# EAGLE design f4mpac (EAGLE 7.4.0)
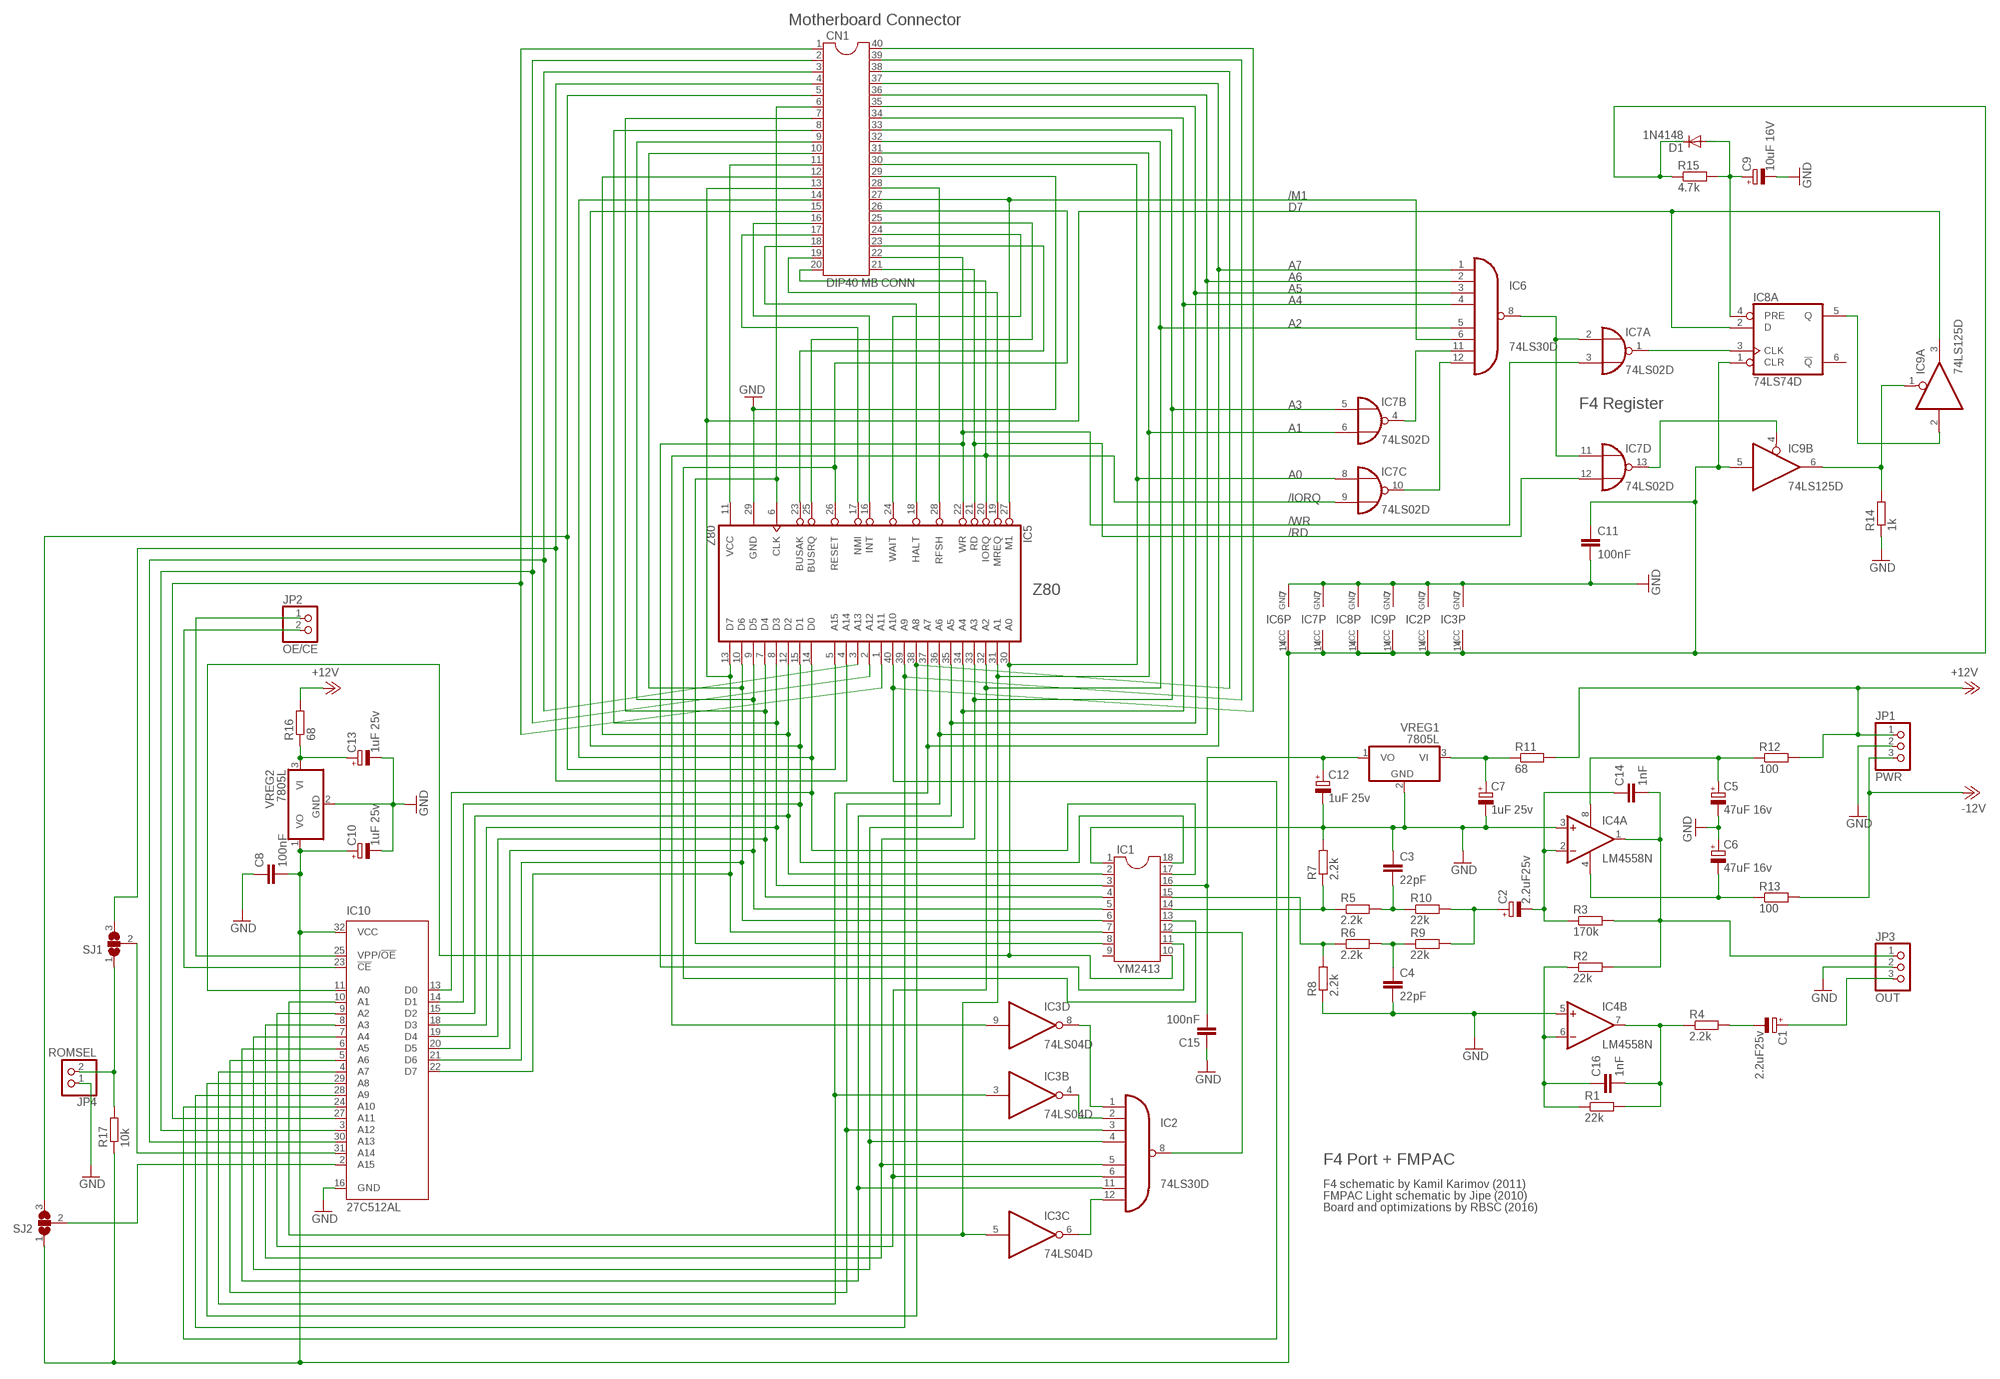
[diagram p0: schematic, sheet 1]

## Parts
C1  2.2uF25v  CPOL-EUSMCB  [SMC_B]
C2  2.2uF25v  CPOL-EUSMCB  [SMC_B]
C3  22pF  C-EUC0805  [C0805]
C4  22pF  C-EUC0805  [C0805]
C5  47uF 16v  CPOL-EUSMCC  [SMC_C]
C6  47uF 16v  CPOL-EUSMCC  [SMC_C]
C7  1uF 25v  CPOL-EUSMCB  [SMC_B]
C8  100nF  C-EUC0805  [C0805]
C9  10uF 16V  CPOL-EUSMCB  [SMC_B]
C10  1uF 25v  CPOL-EUSMCB  [SMC_B]
C11  100nF  C-EUC0805  [C0805]
C12  1uF 25v  CPOL-EUSMCB  [SMC_B]
C13  1uF 25v  CPOL-EUSMCB  [SMC_B]
C14  1nF  C-EUC0805  [C0805]
C15  100nF  C-EUC0805  [C0805]
C16  1nF  C-EUC0805  [C0805]
CN1  DIP40 MB CONN  DIL40  [DIL40]
D1  1N4148  DIODE-MINIMELF  [MINIMELF]
IC1  YM2413  DIL18  [DIL18]
IC2  74LS30D  [SO14]
IC3  74LS04D  [SO14]
IC4  LM4558N  [DIL08]
IC5  Z80  Z80CPU  [DIL40]
IC6  74LS30D  [SO14]
IC7  74LS02D  [SO14]
IC8  74LS74D  [SO14]
IC9  74LS125D  [SO14]
IC10  27C512AL  [PLCC-32]
JP1  PWR  PINHD-1X3/90  [1X03/90]
JP2  OE/CE  PINHD-1X2/90  [1X02/90]
JP3  OUT  PINHD-1X3/90  [1X03/90]
JP4  ROMSEL  PINHD-1X2/90  [1X02/90]
R1  22k  R-EU_R0805  [R0805]
R2  22k  R-EU_R0805  [R0805]
R3  170k  R-EU_R0805  [R0805]
R4  2.2k  R-EU_R0805  [R0805]
R5  2.2k  R-EU_R0805  [R0805]
R6  2.2k  R-EU_R0805  [R0805]
R7  2.2k  R-EU_R0805  [R0805]
R8  2.2k  R-EU_R0805  [R0805]
R9  22k  R-EU_R0805  [R0805]
R10  22k  R-EU_R0805  [R0805]
R11  68  R-EU_R0805  [R0805]
R12  100  R-EU_R0805  [R0805]
R13  100  R-EU_R0805  [R0805]
R14  1k  R-EU_R0805  [R0805]
R15  4.7k  R-EU_M0805  [M0805]
R16  68  R-EU_R0805  [R0805]
R17  10k  R-EU_R0805  [R0805]
SJ1  SJ2W  [SJ_2]
SJ2  SJ2W  [SJ_2]
VREG1  7805L  [TO92]
VREG2  7805L  [TO92]

## Nets
+5VREG: C8.2 C10.+ C11.1 D1.C IC2.14(VCC) IC3.14(P:VCC) IC6.14(VCC) IC7.14(P:VCC) IC8.1(A:CLR) IC8.14(P:VCC) IC9.5(B:I) IC9.14(P:VCC) IC10.32(VCC) R15.1 R17.1 SJ2.1 VREG2.1(VO)
+12V: JP1.1 R11.2 R12.2 R16.2
-12V: JP1.3 R13.2
A0: CN1.30 IC1.10 IC5.30(A0) IC7.8(C:I0) IC10.11(A0)
A1: CN1.31 IC3.5(C:I) IC5.31(A1) IC7.6(B:I1) IC10.10(A1)
A2: CN1.32 IC2.6(I5) IC5.32(A2) IC6.5(I4) IC10.9(A2)
A3: CN1.33 IC2.5(I4) IC5.33(A3) IC7.5(B:I0) IC10.8(A3)
A4: CN1.34 IC2.4(I3) IC5.34(A4) IC6.4(I3) IC10.7(A4)
A5: CN1.35 IC2.11(I6) IC5.35(A5) IC6.3(I2) IC10.6(A5)
A6: CN1.36 IC2.3(I2) IC5.36(A6) IC6.2(I1) IC10.5(A6)
A7: CN1.37 IC3.3(B:I) IC5.37(A7) IC6.1(I0) IC10.4(A7)
A8: CN1.38 IC5.38(A8) IC10.29(A8)
A9: CN1.39 IC5.39(A9) IC10.28(A9)
A10: CN1.40 IC5.40(A10) IC10.24(A10)
A11: CN1.1 IC5.1(A11) IC10.27(A11)
A12: CN1.2 IC5.2(A12) IC10.3(A12)
A13: CN1.3 IC5.3(A13) IC10.30(A13)
A14: CN1.4 IC5.4(A14) SJ1.3
A15: CN1.5 IC5.5(A15) SJ2.3
BUSAK: CN1.23 IC5.23(BUSAK)
BUSRQ: CN1.25 IC5.25(BUSRQ)
CLCK: CN1.6 IC1.8 IC5.6(CLK)
D0: CN1.14 IC1.17 IC5.14(D0) IC10.13(D0)
D1: CN1.15 IC1.18 IC5.15(D1) IC10.14(D1)
D2: CN1.12 IC1.2 IC5.12(D2) IC10.15(D2)
D3: CN1.8 IC1.3 IC5.8(D3) IC10.18(D3)
D4: CN1.7 IC1.4 IC5.7(D4) IC10.19(D4)
D5: CN1.9 IC1.5 IC5.9(D5) IC10.20(D5)
D6: CN1.10 IC1.6 IC5.10(D6) IC10.21(D6)
D7: CN1.13 IC1.7 IC5.13(D7) IC8.2(A:D) IC9.3(A:O) IC10.22(D7)
GND: C3.1 C4.2 C5.- C6.+ C7.- C8.1 C9.- C10.- C11.2 C12.- C13.- C15.1 CN1.29 IC1.1 IC2.7(GND) IC3.7(P:GND) IC4.3(A:+IN) IC4.5(B:+IN) IC5.29(GND) IC6.7(GND) IC7.7(P:GND) IC8.7(P:GND) IC9.7(P:GND) IC10.16(GND) JP1.2 JP3.2 JP4.1 R7.2 R8.1 R14.1 VREG1.2(GND) VREG2.2(GND)
HALT: CN1.18 IC5.18(HALT)
INT: CN1.16 IC5.16(INT)
IORQ: CN1.20 IC3.9(D:I) IC5.20(IORQ) IC7.9(C:I1)
M1: CN1.27 IC5.27(M1) IC6.6(I5)
MREQ: CN1.19 IC5.19(MREQ)
N$1: IC1.12 IC2.8(O)
N$2: C1.+ JP3.3
N$3: C7.+ R11.1 VREG1.3(VI)
N$5: C5.+ IC4.8(P:V+) R12.1
N$6: IC1.14 R5.1 R7.1
N$7: C2.- C14.1 IC4.2(A:-IN) R3.1
N$8: C6.- IC4.4(P:V-) R13.1
N$9: C16.1 IC4.6(B:-IN) R1.1 R2.1
N$10: IC10.31(A14) SJ1.2
N$11: C1.- R4.2
N$12: C3.2 R5.2 R10.1
N$13: IC1.15 R6.1 R8.2
N$14: C4.1 R6.2 R9.1
N$15: IC2.12(I7) IC3.6(C:O)
N$16: C2.+ R9.2 R10.2
N$17: IC2.2(I1) IC3.4(B:O)
N$18: IC2.1(I0) IC3.8(D:O)
N$19: C9.+ D1.A IC8.4(A:PRE) R15.2
N$20: IC10.25(VPP/!OE) JP2.1
N$21: IC10.23(!CE) JP2.2
N$22: C13.+ R16.1 VREG2.3(VI)
N$23: C12.+ C15.2 IC1.16 VREG1.1(VO)
N$24: IC6.11(I6) IC7.4(B:O)
N$25: IC10.2(A15) SJ2.2
N$26: JP4.2 R17.2 SJ1.1
N$27: C16.2 IC4.7(B:OUT) R1.2 R4.1
N$30: IC6.12(I7) IC7.10(C:O)
N$31: IC7.1(A:O) IC8.3(A:CLK)
N$32: IC7.13(D:O) IC9.4(B:OE)
N$33: IC6.8(O) IC7.2(A:I0) IC7.11(D:I0)
N$38: IC9.1(A:OE) IC9.6(B:O) R14.2
N$40: C14.2 IC4.1(A:OUT) JP3.1 R2.2 R3.2
N$41: IC8.5(A:Q) IC9.2(A:I)
NMI: CN1.17 IC5.17(NMI)
RD: CN1.21 IC5.21(RD) IC7.12(D:I1)
RFSH: CN1.28 IC5.28(RFSH)
RST: CN1.26 IC1.13 IC5.26(RESET)
VCC: CN1.11 IC5.11(VCC)
WAIT: CN1.24 IC5.24(WAIT)
WR: CN1.22 IC1.11 IC5.22(WR) IC7.3(A:I1)
Unconnected: IC1.9 IC3.1(A:I) IC3.2(A:O) IC3.10(E:O) IC3.11(E:I) IC3.12(F:O) IC3.13(F:I) IC8.6(A:!Q) IC8.8(B:!Q) IC8.9(B:Q) IC8.10(B:PRE) IC8.11(B:CLK) IC8.12(B:D) IC8.13(B:CLR) IC9.8(C:O) IC9.9(C:I) IC9.10(C:OE) IC9.11(D:O) IC9.12(D:I) IC9.13(D:OE)

## Notes on the sheet
- Motherboard Connector
- /M1
- D7
- A7
- A6
- A5
- A4
- A2
- A3 | F4 Register
- A1
- A0
- /IORQ
- /WR
- /RD
- Z80
- F4 Port + FMPAC
- F4 schematic by Kamil Karimov (2011)
- FMPAC Light schematic by Jipe (2010)
- Board and optimizations by RBSC (2016)

## Library data of the parts
C1 C2 C5-C7 C9 C10 C12 C13 = rcl:CPOL-EU: POLARIZED CAPACITOR, European symbol
C3 C4 C8 C11 C14-C16 = rcl:C-EU: CAPACITOR, European symbol
CN1 = ic-package:DIL40: Dual In Line
D1 = diode:DIODE-: DIODE
IC1 = ic-package:DIL18: Dual In Line / Socket
IC2 IC6 = 74xx-eu:74*30: 8-input NAND gate
IC3 = 74xx-eu:74*04: Hex INVERTER
IC4 = linear:*4558: OP AMP
IC5 = zilog:Z80CPU: Z80 FAMILY DEVICE
IC7 = 74xx-eu:74*02: Quad 2-input NOR gate
IC8 = 74xx-eu:74*74: Dual D type positive edge triggered FLIP FLOP, preset and clear
IC9 = 74xx-eu:74*125: Quad bus BUFFER, 3-state
IC10 = microchip:27*512A: CMOS EPROM 512 K (64 K x 8); MPN: M27C512-90C1; OC_FARNELL: 1218315; OC_NEWARK: 24M5090
JP1 JP3 = pinhead:PINHD-1X3: PIN HEADER
JP2 JP4 = pinhead:PINHD-1X2: PIN HEADER
R1-R17 = rcl:R-EU_: RESISTOR, European symbol
SJ1 SJ2 = jumper:SJ2W: SMD solder JUMPER
VREG1 VREG2 = linear:78*: Positive VOLTAGE REGULATOR Source: http://cache.national.com/ds/LM/LM78L05.pdf http://www.fairchildsemi.com/ds/LM/LM7805.pdf

## Board
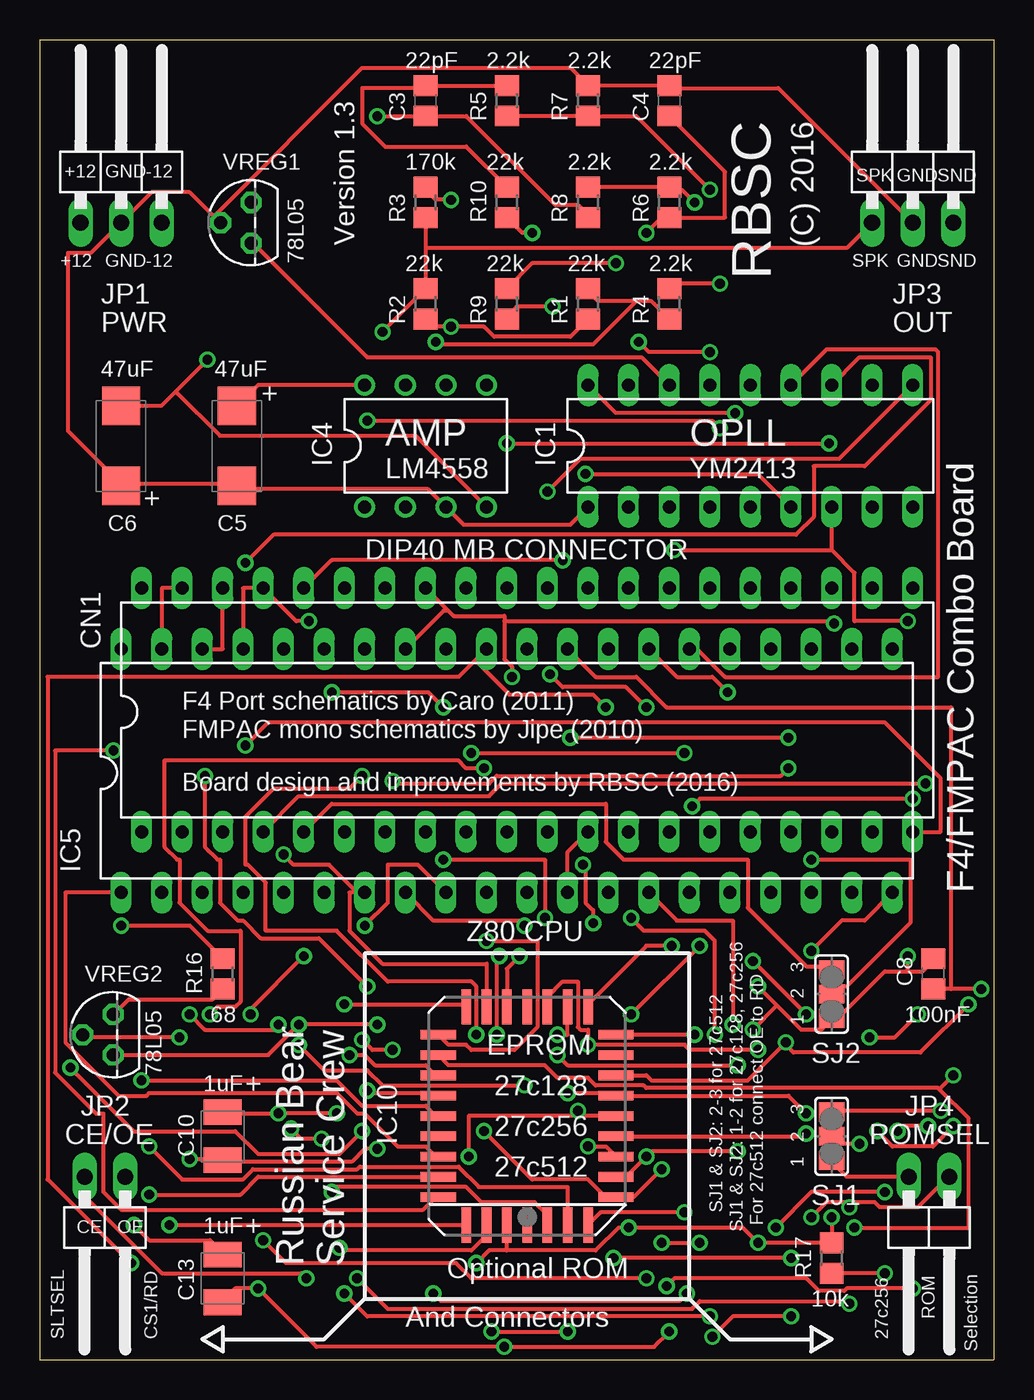
[diagram p1: board, top side]
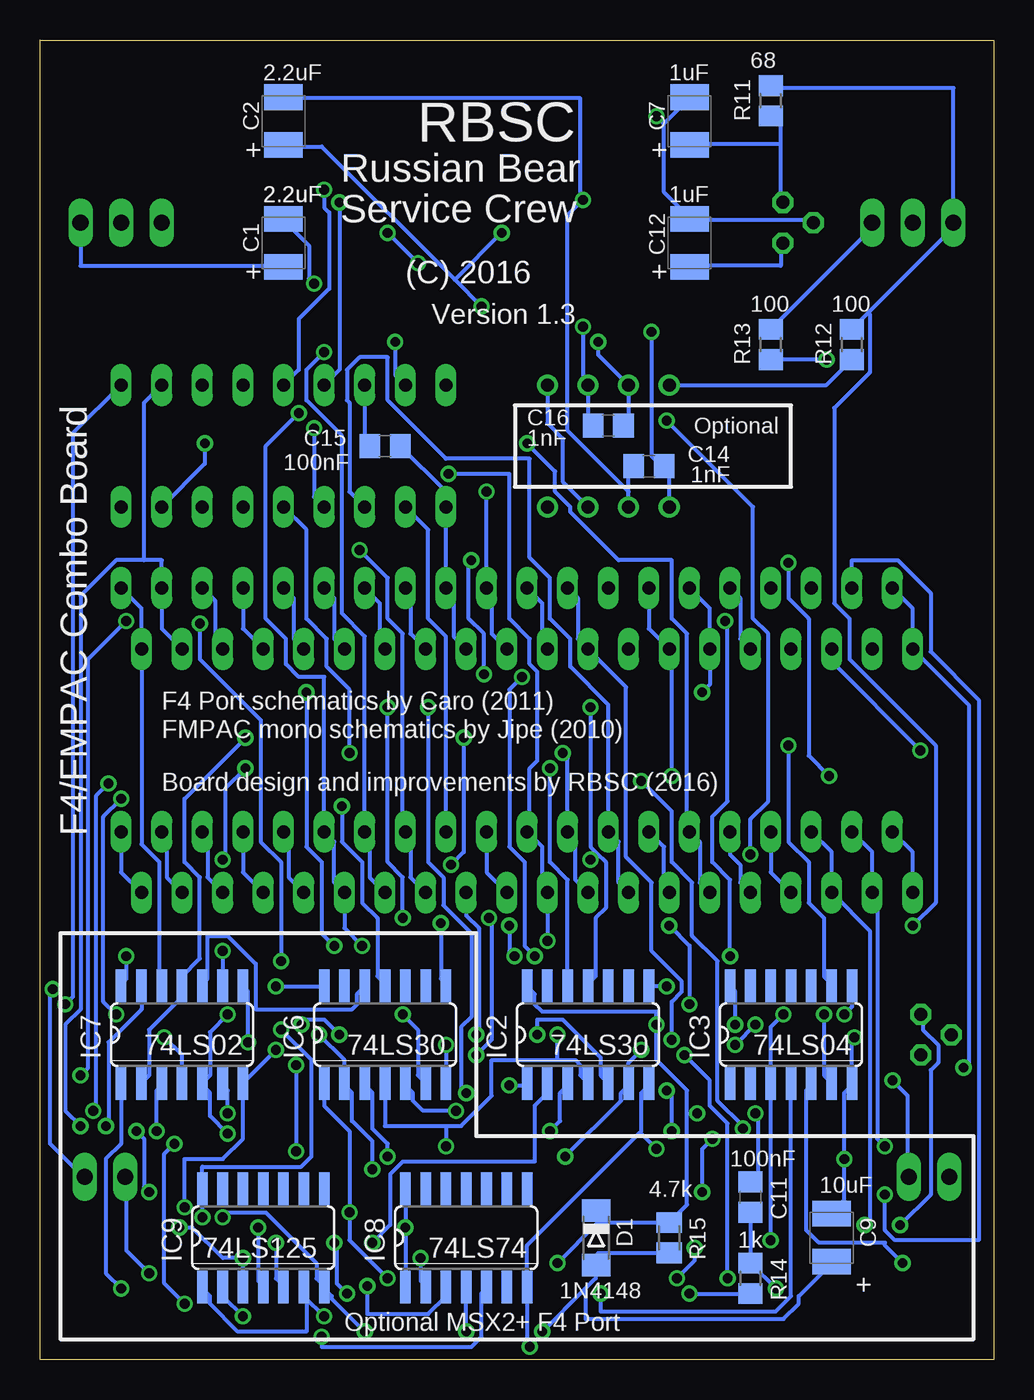
[diagram p2: board, bottom side, seen from below]

Size 59.69 x 82.55 mm. Coordinates in mm from the lower left corner, seen from the top.
Outline: 59.69,82.54 0,82.54 0,0 59.69,0 59.69,82.54
Outline: 59.69,82.55 59.69,82.54
Copper layers (1*16): Top 0.035mm / dielectric 1.5mm / Bottom 0.035mm
Design rules "default *": minimum track width 10mil, minimum drill 24mil, track to track 8mil, track to pad 8mil, pad to pad 8mil, via to via 8mil, smd to smd 8mil, copper to edge 8mil, drill to drill 8mil, minimum pad ring 10mil, minimum via ring 8mil, stop-mask expansion 4mil, vias tented up to drill 24mil, thermal gap 10mil

### Footprints (pad centres in the part's own frame; a part is rotated, then mirrored left to right if it is on the bottom)
SMC_B = smd 1.6 x 2.4: + -1.5,0; - 1.5,0
C0805 = smd 1.3 x 1.5: 1 -0.95,0; 2 0.95,0
SMC_C = smd 2.4 x 2.4: + -2.5,0; - 2.5,0
DIL40 = drill 0.813 long: 1 -24.13,-7.62; 2 -21.59,-7.62; 3 -19.05,-7.62; 4 -16.51,-7.62; 5 -13.97,-7.62; 6 -11.43,-7.62; 7 -8.89,-7.62; 8 -6.35,-7.62; 9 -3.81,-7.62; 10 -1.27,-7.62; 11 1.27,-7.62; 12 3.81,-7.62; 13 6.35,-7.62; 14 8.89,-7.62; 15 11.43,-7.62; 16 13.97,-7.62; 17 16.51,-7.62; 18 19.05,-7.62; 19 21.59,-7.62; 20 24.13,-7.62; 21 24.13,7.62; 22 21.59,7.62; 23 19.05,7.62; 24 16.51,7.62; 25 13.97,7.62; 26 11.43,7.62; 27 8.89,7.62; 28 6.35,7.62; 29 3.81,7.62; 30 1.27,7.62; 31 -1.27,7.62; 32 -3.81,7.62; 33 -6.35,7.62; 34 -8.89,7.62; 35 -11.43,7.62; 36 -13.97,7.62; 37 -16.51,7.62; 38 -19.05,7.62; 39 -21.59,7.62; 40 -24.13,7.62
MINIMELF = smd 1.4 x 1.8: A 1.7,0; C -1.7,0
DIL18 = drill 0.813 long: 1 -10.16,-3.81; 2 -7.62,-3.81; 3 -5.08,-3.81; 4 -2.54,-3.81; 5 0,-3.81; 6 2.54,-3.81; 7 5.08,-3.81; 8 7.62,-3.81; 9 10.16,-3.81; 10 10.16,3.81; 11 7.62,3.81; 12 5.08,3.81; 13 2.54,3.81; 14 0,3.81; 15 -2.54,3.81; 16 -5.08,3.81; 17 -7.62,3.81; 18 -10.16,3.81
SO14 = smd 0.66 x 2.032: 1 -3.81,-3.073; 2 -2.54,-3.073; 3 -1.27,-3.073; 4 0,-3.073; 5 1.27,-3.073; 6 2.54,-3.073; 7 3.81,-3.073; 8 3.81,3.073; 9 2.54,3.073; 10 1.27,3.073; 11 0,3.073; 12 -1.27,3.073; 13 -2.54,3.073; 14 -3.81,3.073
DIL08 = drill 0.813 pad 1.27: 1 -3.81,-3.81; 2 -1.27,-3.81; 3 1.27,-3.81; 4 3.81,-3.81; 5 3.81,3.81; 6 1.27,3.81; 7 -1.27,3.81; 8 -3.81,3.81
PLCC-32 = smd 2.2 x 0.6: 1 -6.83,0; 2 -6.83,-1.27; 3 -6.83,-2.54; 4 -6.83,-3.81; 14 6.83,-3.81; 15 6.83,-2.54; 16 6.83,-1.27; 17 6.83,0; 18 6.83,1.27; 19 6.83,2.54; 20 6.83,3.81; 30 -6.83,3.81; 31 -6.83,2.54; 32 -6.83,1.27 | smd 0.6 x 2.2: 5 -5.08,-5.56; 6 -3.81,-5.56; 7 -2.54,-5.56; 8 -1.27,-5.56; 9 0,-5.56; 10 1.27,-5.56; 11 2.54,-5.56; 12 3.81,-5.56; 13 5.08,-5.56; 21 5.08,5.56; 22 3.81,5.56; 23 2.54,5.56; 24 1.27,5.56; 25 0,5.56; 26 -1.27,5.56; 27 -2.54,5.56; 28 -3.81,5.56; 29 -5.08,5.56
1X03/90 = drill 1.016 long: 1 -2.54,-3.81; 2 0,-3.81; 3 2.54,-3.81
1X02/90 = drill 1.016 long: 1 -1.27,-3.81; 2 1.27,-3.81
R0805 = smd 1.3 x 1.5: 1 -0.95,0; 2 0.95,0
M0805 = smd 1.3 x 1.6: 1 -0.95,0; 2 0.95,0
SJ_2 = smd 1.168 x 1.6: 1 -1.524,0; 2 0,0; 3 1.524,0
TO92 = drill 0.813 octagon: 1 -1.27,0; 2 0,1.905; 3 1.27,0

### Placement (x,y rotation side)
C1  44.45,69.85 90 bottom
C2  44.45,77.47 90 bottom
C3  24.13,78.74 90 top
C4  39.37,78.74 90 top
C5  12.32,57.15 270 top
C6  5.08,57.15 90 top
C7  19.05,77.47 90 bottom
C8  55.88,24.13 90 top
C9  10.16,7.62 90 bottom
C10  11.43,13.97 270 top
C11  15.24,10.16 270 bottom
C12  19.05,69.85 90 bottom
C13  11.43,5.08 270 top
C14  21.59,55.88 0 bottom
C15  38.1,57.15 180 bottom
C16  24.13,58.42 0 bottom
CN1  30.48,40.64 0 top
D1  24.89,7.62 270 bottom
IC1  44.45,57.15 0 top
IC2  25.4,20.32 0 bottom
IC3  12.7,20.32 0 bottom
IC4  24.13,57.15 0 top
IC5  29.21,36.83 0 top
IC6  38.1,20.32 0 bottom
IC7  50.8,20.32 0 bottom
IC8  33.02,7.62 0 bottom
IC9  45.72,7.62 0 bottom
IC10  30.48,15.24 90 top
JP1  5.08,74.93 0 top
JP2  4.06,7.62 180 top
JP3  54.61,74.93 0 top
JP4  55.63,7.62 180 top
R1  34.29,66.04 90 top
R2  24.13,66.04 90 top
R3  24.13,72.39 270 top
R4  39.37,66.04 90 top
R5  29.21,78.74 90 top
R6  39.37,72.39 270 top
R7  34.29,78.74 90 top
R8  34.29,72.39 90 top
R9  29.21,66.04 270 top
R10  29.21,72.39 270 top
R11  13.97,78.74 90 bottom
R12  8.89,63.5 90 bottom
R13  13.97,63.5 90 bottom
R14  15.24,5.08 270 bottom
R15  20.32,7.62 270 bottom
R16  11.43,24.13 90 top
R17  49.53,6.35 270 top
SJ1  49.53,13.97 90 top
SJ2  49.53,22.86 90 top
VREG1  13.21,71.12 90 top
VREG2  4.57,20.32 90 top

### Tracks (layer width: path | path; a pad name or v marks a point on that pad's centre or on a via)
+5VREG  (via drill 0.61)
  Top 0.254: VREG2.1 14.29,19.05 v16.19,20.95 v21.11,20.95 | C10.+ 11.43,15.4 v14.92,15.4 v18.57,15.4 | 54.29,24.29 52.86,24.29 50.01,21.43 49.53,21.43 SJ2.1 49.53,21.27 48.9,20.64 47.62,20.64 46.12,22.15 | 54.29,24.29 55.24,24.29 55.88,24.92 C8.2 | 46.12,22.15 v44.93,23.34 | 54.29,24.29 v54.29,25.24 | v49.53,8.89 R17.1 | R17.1 v44.93,7.3 43.97,8.26 v36.83,8.26 36.2,8.26 34.77,6.83 29.21,6.83 | R17.1 | 29.21,6.83 IC10.32 | v44.61,20.64 46.12,22.15 | v27.3,6.03 28.1,6.83 29.21,6.83
  Bottom 0.254: v16.19,20.95 16.19,23.02 16.51,23.34 IC3.14 | v14.92,15.4 14.76,15.24 14.76,11.59 C11.1 | 24.77,8.57 R15.1 | 24.77,8.57 24.77,9.21 D1.C | 19.21,15.4 19.21,9.68 R15.1 | 19.21,15.4 19.21,16.83 21.11,18.73 v21.11,20.95 21.11,21.75 28.26,21.75 28.73,22.23 28.73,22.86 29.21,23.34 IC2.14 | R15.1 | 19.21,15.4 v18.57,15.4 | v44.93,23.34 41.91,23.34 IC6.14 | v54.29,25.24 54.29,23.81 54.61,23.5 IC7.14 | IC8.14 v36.83,8.26 IC8.1 | v49.53,8.89 IC9.14 49.53,12.06 43.34,12.06 42.7,12.7 42.7,18.73 v44.61,20.64 | v44.93,7.3 44.93,5.08 44.45,4.6 IC9.5 | v27.3,6.03 24.77,8.57
+12V  (via drill 0.61)
  Top 0.254: v5.08,27.15 9.37,27.15 R16.2
  Bottom 0.254: 7.86,65.48 2.54,70.8 JP1.1 2.54,79.53 13.97,79.53 R11.2 | 7.86,65.48 R12.2 | v5.08,27.15 3.65,28.57 3.65,38.42 9.05,43.81 9.05,46.35 10,47.31 10,59.53 7.78,61.75 7.78,65.41 7.86,65.48
-12V
  Bottom 0.254: JP1.3 7.62,70.8 R13.2
A0  (via drill 0.61)
  Top 0.254: IC10.11 37.94,17.78 38.26,17.46 44.29,17.46 v46.67,19.84 46.67,19.68 47.15,19.21 55.09,19.21 v58.1,22.23 | IC1.10 50.01,56.36 33.81,56.36 v31.75,54.29
  Bottom 0.254: v46.67,19.84 46.67,23.02 46.99,23.34 IC7.8 | IC5.30 31.43,45.4 31.43,47.94 CN1.30 v31.75,54.29 | v58.1,22.23 57.63,22.7 57.63,57.94 IC1.10
A1  (via drill 0.61)
  Top 0.254: v47.94,15.4 46.83,16.51 IC10.10 35.88,16.67 v33.02,16.67 | v5.71,6.03 0.48,11.27 0.48,42.7 26.19,42.7 IC5.31 27.3,43.66 29.37,41.59 34.61,41.59 v35.4,40.8
  Bottom 0.254: v47.94,15.4 47.94,16.83 48.26,17.14 IC7.6 | v5.71,6.03 6.83,7.14 6.83,7.3 10.95,7.3 11.75,8.1 11.75,16.83 11.43,17.14 IC3.5 | CN1.31 28.26,47.31 28.26,44.77 IC5.31 | v33.02,16.67 33.34,16.99 33.34,20.8 32.7,21.43 32.7,26.67 34.45,28.42 34.45,30.16 35.4,31.11 v35.4,40.8
A2  (via drill 0.61)
  Top 0.254: v26.83,12.7 26.83,15.24 33.66,15.24 | IC10.9 33.66,15.24 | 33.66,15.24 v33.66,15.56 | v20.16,20 20.8,19.37 v22.07,19.37
  Bottom 0.254: CN1.32 26.04,47.62 26.04,45.09 IC5.32 23.02,42.07 23.02,31.43 21.43,29.84 21.43,25.56 19.53,23.65 19.53,23.02 20.16,22.38 v20.16,20 | v26.83,12.7 23.34,16.19 23.34,16.67 22.86,17.14 IC2.6 22.86,18.57 v22.07,19.37 | v33.66,15.56 35.72,15.56 36.35,16.19 36.35,16.67 36.83,17.14 IC6.5
A3  (via drill 0.61)
  Top 0.254: v47.94,14.13 47.78,13.97 IC10.8 | v28.57,20.32 28.57,25.24 v28.73,25.24 | v29.53,42.7 29.53,43.34 29.05,43.81 29.05,46.2 | 29.05,46.2 29.05,46.51 25.88,46.51 25.48,46.91 | CN1.33 25.48,46.91 | IC5.33 25.24,46.83 25.4,46.83 25.48,46.91 | v44.61,24.92 v47.94,21.59 | v49.69,46.04 49.53,46.2 29.05,46.2
  Bottom 0.254: v47.94,14.13 49.05,15.24 49.05,16.67 49.53,17.14 IC7.5 49.53,17.3 49.05,17.78 49.05,20.48 v47.94,21.59 | v28.57,20.32 28.57,21.27 26.99,21.27 24.61,18.89 24.61,17.78 24.13,17.3 IC2.5 | v28.73,25.24 29.37,25.88 29.37,31.11 30.32,32.07 30.32,41.91 v29.53,42.7 | v44.61,24.92 44.61,31.11 45.88,32.38 45.88,40.01 49.69,43.81 v49.69,46.04
A4  (via drill 0.61)
  Top 0.254: v34.29,13.34 35.4,13.34 IC10.7 | v20.16,36.51 19.37,35.72 14.61,35.72 12.86,33.97 12.86,30.96 13.02,30.96 14.13,29.84 14.13,26.83 18.57,26.83 21.75,23.65 26.99,23.65 27.3,23.34 v27.3,20.32
  Bottom 0.254: CN1.34 21.59,45.72 IC5.34 20.16,44.29 v20.16,36.51 | 27.3,18.73 31.43,18.73 31.43,16.51 33.34,14.61 34.29,14.61 | 27.3,18.73 26.19,18.73 25.88,18.41 25.88,17.78 25.4,17.3 IC2.4 | 34.29,14.61 38.1,14.61 IC6.4 | 34.29,14.61 v34.29,13.34 | 27.3,18.73 v27.3,20.32
A5  (via drill 0.61)
  Top 0.254: IC10.6 36.67,11.43 v37.94,12.7 38.26,13.02 v43.66,13.02 | v25.24,40.8 24.29,41.75 v18.26,41.75 | v43.66,18.41 33.02,18.41 v32.38,19.05 | v31.59,27.62 31.59,31.27 v25.24,31.27
  Bottom 0.254: v37.94,12.7 37.94,13.49 38.89,14.45 38.89,16.67 39.37,17.14 IC6.3 | 24.84,31.67 25.24,32.07 v25.24,40.8 | 24.84,31.67 24.29,31.11 24.29,28.26 24.92,27.62 24.92,23.97 25.4,23.5 IC2.11 | v18.26,41.75 17.78,42.23 IC5.35 17.78,46.99 CN1.35 | v43.66,18.41 v43.66,13.02 | v32.38,19.05 31.43,20 31.43,27.46 v31.59,27.62 | 24.84,31.67 v25.24,31.27
A6  (via drill 0.61)
  Top 0.254: v27.78,14.29 30.8,11.27 34.29,11.27 35.4,10.16 IC10.5 37.15,10.16 v38.89,11.91 | CN1.36 18.26,50.01 v32.7,50.01 | v31.91,42.86 32.7,42.07 36.67,42.07 v37.94,40.8 | v36.99,27.62 37.78,26.83 41.59,26.83 42.23,26.19 v42.23,20.32
  Bottom 0.254: IC5.36 15.88,45.09 15.88,47.62 CN1.36 | v27.78,14.29 27.15,14.92 27.15,16.67 26.67,17.14 IC2.3 | v38.89,11.91 38.89,13.65 40.16,14.92 40.16,16.67 40.64,17.14 IC6.2 40.64,18.73 v42.23,20.32 | v32.7,50.01 32.86,49.85 32.86,46.35 31.91,45.4 v31.91,42.86 | v37.94,40.8 37.94,31.11 36.99,30.16 v36.99,27.62
A7  (via drill 0.61)
  Top 0.254: IC5.37 12.7,48.26 CN1.37 16.03,46.2 v16.83,46.2 | v13.97,7.46 15.4,6.03 26.04,6.03 26.99,5.08 v37.94,5.08 | v40.32,9.21 35.08,9.21 IC10.4 | v16.51,25.24 13.18,21.91 v13.18,21.59
  Bottom 0.254: v13.97,7.46 IC3.3 13.97,20.8 v13.18,21.59 | v37.94,5.08 40.32,7.46 v40.32,9.21 40.32,14.29 41.91,15.88 IC6.1 | v16.83,46.2 16.67,46.04 16.67,34.92 17.62,33.97 17.62,31.11 16.51,30 v16.51,25.24
A8  (via drill 0.61)
  Top 0.254: v4.6,38.1 0.95,38.1 0.95,17.94 3.49,15.4 3.97,15.4 3.97,10.48 5.08,9.37 23.97,9.37 24.77,10.16 IC10.29 | CN1.38 11.43,44.45 IC5.38
  Bottom 0.254: v4.6,38.1 10.16,43.66 IC5.38
A9  (via drill 0.61)
  Top 0.254: IC10.28 13.65,11.43 12.54,10.32 v6.83,10.32 | IC5.39 7.62,48.26 CN1.39
  Bottom 0.254: v6.83,10.32 6.83,8.1 6.19,7.46 0.95,7.46 0.95,41.27 3.97,44.29 3.97,47.94 6.03,50.01 8.89,50.01 CN1.39
A10  (via drill 0.61)
  Top 0.254: v20.48,16.83 20.64,16.67 24.61,16.67 24.77,16.51 IC10.24 | v20.16,14.29 18.73,12.86 13.65,12.86 12.22,14.29 5.87,14.29 v1.91,18.26
  Bottom 0.254: v20.48,16.83 20.16,16.51 v20.16,14.29 | v1.91,18.26 1.59,18.57 1.59,40.96 IC5.40 5.08,46.99 CN1.40
A11
  Top 0.254: IC5.1 1.59,29.21 1.59,19.84 4.92,16.51 6.67,16.51 6.83,16.67 18.57,16.67 19.84,15.4 20.32,15.4 22.38,13.34 24.13,13.34 24.77,12.7 IC10.27
  Bottom 0.254: CN1.1 5.08,31.75 IC5.1
A12  (via drill 0.61)
  Top 0.254: IC10.3 33.02,10.79 27.46,10.79 26.19,12.06 20,12.06 19.84,11.91 13.34,11.91 12.7,11.27 8.89,11.27 v6.83,13.34
  Bottom 0.254: v6.83,13.34 7.3,13.81 7.3,28.89 IC5.2 7.62,31.75 CN1.2
A13  (via drill 0.61)
  Top 0.254: v8.1,8.41 IC10.30
  Bottom 0.254: v8.1,8.41 7.78,8.73 7.78,26.83 IC5.3 10.16,31.75 CN1.3
A14  (via drill 0.61)
  Top 0.254: v56.36,15.56 49.53,15.56 SJ1.3 | v55.4,36.04 28.89,36.04 28.1,35.24 16.19,35.24 CN1.4
  Bottom 0.254: v56.36,15.56 56.2,15.72 56.2,35.24 v55.4,36.04 | IC5.4 13.97,30.48 CN1.4
A15
  Top 0.254: CN1.5 18.26,34.77 35.4,34.77 35.4,32.38 36.51,31.27 44.29,31.27 44.29,28.26 47.94,24.61 49.37,24.61 49.53,24.45 SJ2.3
  Bottom 0.254: IC5.5 15.88,29.84 15.88,30.96 16.51,31.59 CN1.5
BUSAK
  Bottom 0.254: IC5.23 48.74,44.93 48.74,47.47 CN1.23
BUSRQ
  Bottom 0.254: IC5.25 43.81,45.09 43.81,47.62 CN1.25
CLCK  (via drill 0.61)
  Top 0.254: v29.21,57.31 v49.37,57.31
  Bottom 0.254: IC5.6 18.41,29.84 18.41,32.38 CN1.6 19.21,33.18 19.21,45.4 20.16,46.35 20.16,50.01 23.5,50.01 26.51,53.02 26.51,53.34 27.46,54.29 27.46,55.56 v29.21,57.31 | IC1.8 49.37,56.04 v49.37,57.31
D0  (via drill 0.61)
  Top 0.254: v40.96,20.32 IC10.13 | v43.34,20.95 43.34,27.46 39.85,27.46 IC5.14 | v37.47,63.66 38.1,63.02 v41.91,63.02
  Bottom 0.254: v40.96,20.32 41.91,21.27 43.34,21.27 v43.34,20.95 | IC1.17 37.47,61.59 v37.47,63.66 | v41.91,63.02 43.02,61.91 43.02,60.01 40.8,57.78 40.8,46.67 39.37,45.24 CN1.14 39.05,32.7 39.05,30.16 IC5.14
D1  (via drill 0.61)
  Top 0.254: v39.53,25.88 37.94,25.88 34.29,22.23 IC10.14 | IC1.18 36.04,59.21 v43.5,59.21
  Bottom 0.254: v39.53,25.88 40.64,26.99 IC5.15 41.27,29.84 41.27,32.38 CN1.15 41.91,42.7 43.5,42.7 44.29,43.5 44.29,45.09 45.56,46.35 45.56,57.15 v43.5,59.21
D2  (via drill 0.61)
  Top 0.254: IC10.15 33.02,20.32 v32.38,20.32 | CN1.12 33.02,31.75 IC5.12
  Bottom 0.254: v32.38,20.32 32.23,20.48 32.23,26.99 33.02,27.78 IC5.12 | IC1.2 35.4,51.91 35.4,46.35 34.29,45.24 CN1.12
D3  (via drill 0.61)
  Top 0.254: IC10.18 29.21,24.45 v30,25.24 | v30.32,27.15 30,27.46 24.61,27.46 IC5.8
  Bottom 0.254: v30,25.24 30.32,25.56 v30.32,27.15 | IC5.8 23.5,29.84 23.5,32.38 CN1.8 24.13,40.96 26.51,43.34 26.51,45.09 27.78,46.35 27.78,48.9 29.05,50.16 29.05,56.36 34.29,56.36 37.94,60.01 37.94,62.71 39.69,62.71 40.48,61.91 40.48,60.01 40.32,59.85 40.32,54.29 IC1.3
D4  (via drill 0.61)
  Top 0.254: IC10.19 27.94,24.77 21.43,24.77 19.37,26.83 19.37,29.21 19.84,29.21 | v42.55,58.26 42.07,58.74 v20.48,58.74 | v15.24,31.59 15.88,30.96 18.1,30.96 19.84,29.21 | 19.84,29.21 IC5.7
  Bottom 0.254: CN1.7 20.64,32.07 20.64,29.53 IC5.7 | IC1.4 42.55,53.98 v42.55,58.26 | v20.48,58.74 15.08,53.34 15.08,46.35 14.13,45.4 14.13,34.92 15.24,33.81 v15.24,31.59
D5  (via drill 0.61)
  Top 0.254: v19.05,22.23 26.67,22.23 IC10.20 | v20.32,27.15 21.75,28.57 21.75,30.96 23.65,30.96 IC5.9 | v26.99,37.94 v40.32,37.94
  Bottom 0.254: v19.05,22.23 19.05,25.88 v20.32,27.15 | IC5.9 26.19,30 26.19,32.54 CN1.9 26.67,37.62 v26.99,37.94 | IC1.5 43.02,51.91 43.02,46.35 41.75,45.09 41.75,43.34 40.32,41.91 v40.32,37.94
D6  (via drill 0.61)
  Top 0.254: v27.94,26.19 31.11,26.19 31.11,20.8 29.69,19.37 26.99,19.37 26.67,19.68 25.56,19.68 IC10.21 | IC1.6 44.93,55.4 v34.13,55.4
  Bottom 0.254: v27.94,26.19 IC5.10 28.26,29.53 28.26,32.07 CN1.10 29.05,33.02 29.05,36.99 28.57,37.47 28.57,43.02 29.05,43.5 29.05,45.09 30.32,46.35 30.32,55.4 v34.13,55.4
D7  (via drill 0.61)
  Top 0.254: 49.53,50.64 IC1.7 | v39.69,50.64 49.53,50.64 | v46.99,6.35 v35.88,6.35 | 56.28,16.91 58.1,15.08 58.1,8.26 v50.96,8.26 | 56.28,16.91 56.2,16.99 37.94,16.99 37.78,17.14 34.77,17.14 34.29,17.62 32.38,17.62 31.59,18.41 25.56,18.41 IC10.22 | 49.53,50.64 50.96,49.21 50.96,46.2 v54.29,46.2 | 56.28,16.91 v57.15,17.78
  Bottom 0.254: IC5.13 36.51,30.16 36.51,32.7 CN1.13 36.99,33.18 36.99,45.4 37.94,46.35 37.94,48.9 v39.69,50.64 | v35.88,6.35 35.88,4.92 35.56,4.6 IC8.2 | IC9.3 v46.99,6.35 48.26,6.35 50.16,8.26 v50.96,8.26 | v54.29,46.2 56.67,43.81 56.67,18.26 v57.15,17.78
GND  (via drill 0.61)
  Top 0.254: IC10.16 31.75,22.7 32.7,23.65 33.66,23.65 33.66,20.8 33.81,20.64 34.29,20.64 v34.29,19.68 40.32,19.68 40.64,19.37 v44.93,19.37 | v58.9,23.18 56.99,23.18 | 56.99,23.18 C8.1 | v48.26,8.89 49.21,9.84 50.64,9.84 | 50.64,9.84 52.23,9.84 52.55,9.53 54.93,9.53 56.83,11.43 JP4.1 | 50.64,9.84 v50.64,9.53 | v9.37,12.54 11.43,12.54 C10.- 11.43,12.38 19.53,12.38 20.32,13.18 v21.11,13.18 | v8.73,20.16 2.86,20.16 2.7,20.32 VREG2.2 | C13.- 11.43,3.65 12.22,4.45 v13.65,4.45 17.3,0.79 v29.05,0.79 38.42,0.79 v39.37,1.75 | 5.08,54.77 12.22,54.77 C5.- 12.38,54.61 12.54,54.45 24.29,54.45 IC4.3 26.51,52.23 33.18,52.23 IC1.1 | R7.2 C4.2 39.37,79.53 46.2,79.53 JP3.2 | C3.1 26.67,77.79 32.23,72.23 33.66,72.23 34.29,71.6 R8.1 | v21.11,77.79 C3.1 | C3.1 | R7.2 33.18,80.8 20.16,80.8 10.95,71.6 VREG1.2 11.27,71.12 9.37,73.03 6.99,73.03 JP1.2 3.17,69.22 1.75,69.22 1.75,58.1 5.08,54.77 | R7.2 | 5.08,54.77 C6.+ | 56.99,23.18 56.99,40.8 39.21,40.8 37.31,42.7 34.77,42.7 IC5.29
  Bottom 0.254: v34.29,19.68 IC6.7 | v58.9,23.18 59.05,23.02 59.05,13.49 56.99,11.43 JP4.1 | v48.26,8.89 48.26,9.21 45.56,9.21 42.39,6.03 42.39,5.08 41.91,4.6 IC9.7 41.91,4.45 41.43,3.97 41.43,3.81 v39.37,1.75 | v50.64,9.53 50.64,12.54 48.26,12.54 46.99,13.81 IC7.7 46.99,17.3 v44.93,19.37 | C9.- 10.16,9.21 9.37,10 v9.37,12.54 9.37,16.67 8.89,17.14 IC3.7 8.89,20 v8.73,20.16 | C11.2 R14.1 | R14.1 v13.65,4.45 | R14.1 | 22.15,14.21 29.21,7.14 IC8.7 29.21,0.95 v29.05,0.79 | 22.15,14.21 22.07,14.29 22.07,16.67 21.59,17.14 IC2.7 | 22.15,14.21 v21.11,13.18 | C15.1 34.29,54.29 IC1.1 CN1.29 33.81,47.78 33.81,45.24 IC5.29 | IC4.3 26.99,54.93 26.99,57.63 27.94,58.58 IC4.5 | VREG1.2 11.43,71.12 11.43,71.28 19.05,71.28 C12.- 19.05,71.44 20.64,73.03 20.64,77.31 | 20.64,77.31 19.05,78.9 C7.- | 20.64,77.31 v21.11,77.79
HALT
  Bottom 0.254: IC5.18 49.21,30.16 49.21,32.7 CN1.18
INT
  Bottom 0.254: IC5.16 44.13,30.16 44.13,32.7 CN1.16
IORQ  (via drill 0.61)
  Top 0.254: v48.26,25.56 50.16,27.46 51.59,27.46 IC5.20 | v12.86,38.42 14.29,39.85 52.86,39.85 56.36,36.35 56.36,33.02 CN1.20
  Bottom 0.254: v48.26,25.56 IC7.9 | v12.86,38.42 12.86,32.38 11.59,31.11 11.59,28.57 10.64,27.62 10.64,23.97 10.16,23.5 IC3.9 | IC5.20 54.61,30.48 CN1.20
M1  (via drill 0.61)
  Top 0.254: v41.27,25.88 v36.99,21.59 | v43.02,41.75 42.07,42.7 39.85,42.7 IC5.27
  Bottom 0.254: v36.99,21.59 36.04,20.64 36.04,17.78 35.56,17.3 IC6.6 | v41.27,25.88 42.07,26.67 42.07,31.11 43.02,32.07 v43.02,41.75 | CN1.27 38.42,47.31 38.42,44.77 IC5.27
MREQ
  Bottom 0.254: IC5.19 51.75,30.16 51.75,32.7 CN1.19
N$1  (via drill 0.61)
  Top 0.254: v20.48,23.34 17.46,26.35 13.81,26.35 12.7,27.46 12.38,27.46 11.27,28.57 11.27,31.27 11.11,31.27 10.32,32.07 v10.32,36.51 | v12.86,49.85 14.61,51.59 47.31,51.59 48.42,52.7 48.42,55.88 51.59,55.88 55.72,60.01 55.72,62.71 51.28,62.71 IC1.12
  Bottom 0.254: v20.48,23.34 21.59,23.34 IC2.8 | v10.32,36.51 11.59,37.78 11.59,46.35 12.86,47.62 v12.86,49.85
N$2
  Bottom 0.254: JP3.3 57.15,68.42 44.45,68.42 C1.+
N$3
  Bottom 0.254: 13.34,76.04 13.34,72.39 VREG1.3 | 13.34,76.04 13.34,77.15 R11.1 | 13.34,76.04 19.05,76.04 C7.+
N$5
  Top 0.254: IC4.8 13.65,60.96 12.38,59.69 C5.+
  Bottom 0.254: IC4.8 10.48,60.96 R12.1
N$6  (via drill 0.61)
  Top 0.254: R7.1 R5.1 | v41.91,73.18 37.31,77.79 R7.1 | R7.1
  Bottom 0.254: IC1.14 43.5,61.91 43.5,65.09 41.59,66.99 41.59,71.75 41.91,72.07 v41.91,73.18
N$7  (via drill 0.61)
  Top 0.254: v25.72,72.55 24.77,72.55 24.13,73.18 R3.1
  Bottom 0.254: IC4.2 22.86,54.29 | 22.86,54.29 22.86,55.56 C14.1 | 22.86,54.29 26.67,58.1 26.67,71.6 v25.72,72.55 25.88,72.55 25.88,78.9 44.45,78.9 C2.-
N$8  (via drill 0.61)
  Top 0.254: 8.49,60.56 7.62,59.69 5.08,59.69 C6.- | 8.49,60.56 v10.48,62.55 | IC4.4 23.5,57.78 11.27,57.78 8.49,60.56
  Bottom 0.254: v10.48,62.55 R13.1
N$9  (via drill 0.61)
  Top 0.254: R2.1 24.61,64.61 v25.72,64.61 27.78,64.61 28.42,63.98 33.18,63.98 R1.1
  Bottom 0.254: C16.1 25.4,58.74 IC4.6 25.72,61.28 v25.72,64.61
N$10  (via drill 0.61)
  Top 0.254: SJ1.2 50.01,13.49 v51.28,13.49 | v50.64,3.49 50.48,3.65 41.27,3.65 40.8,3.17 21.75,3.17 v19.84,5.08 | v18.73,6.99 18.89,6.83 26.99,6.83 27.94,7.78 IC10.31
  Bottom 0.254: v51.28,13.49 51.91,12.86 51.91,4.76 v50.64,3.49 | v19.84,5.08 18.73,6.19 v18.73,6.99
N$11  (via drill 0.61)
  Top 0.254: v42.55,67.31 39.69,67.31 R4.2
  Bottom 0.254: v42.55,67.31 42.86,67.63 42.86,69.69 44.45,71.28 C1.-
N$12
  Top 0.254: R10.1 26.67,75.88 21.59,75.88 20.16,77.31 20.16,79.53 24.13,79.53 C3.2 R5.2
N$13  (via drill 0.61)
  Top 0.254: R8.2 R6.1 39.37,73.18 40.16,73.18 v40.96,72.39
  Bottom 0.254: IC1.15 40.96,61.91 v40.96,72.39
N$14  (via drill 0.61)
  Top 0.254: v36.04,68.58 30.8,68.58 R9.1 | v37.94,70.48 38.89,71.44 R6.2 | R6.2 42.86,71.44 42.86,74.3 C4.1 | R6.2
  Bottom 0.254: v37.94,70.48 v36.04,68.58
N$15  (via drill 0.61)
  Top 0.254: v10.64,21.59 11.11,22.07 12.22,22.07 12.54,22.38 12.54,26.83 10.48,26.83 8.73,28.57 8.73,31.27 8.57,31.27 7.78,32.07 7.78,37.47 26.19,37.47 26.67,36.99 v27.78,36.99
  Bottom 0.254: v10.64,21.59 10.64,17.78 10.16,17.3 IC3.6 | v27.78,36.99 27.78,31.11 26.67,30 IC2.12
N$16  (via drill 0.61)
  Top 0.254: v32.07,65.88 29.84,65.88 29.21,65.25 R9.2 | v30.8,70.48 30.16,70.48 R10.2
  Bottom 0.254: 33.73,67.55 42.07,75.88 44.45,75.88 C2.+ | 33.73,67.55 v32.07,65.88 | 33.73,67.55 v30.8,70.48
N$17  (via drill 0.61)
  Top 0.254: v24.61,4.13 25.08,3.65 40.01,3.65 v40.48,4.13 | v38.89,7.3 v41.27,7.3
  Bottom 0.254: IC3.4 12.7,3.97 13.65,3.02 24.61,3.02 v24.61,4.13 | v40.48,4.13 41.12,4.76 41.12,7.14 v41.27,7.3 | v38.89,7.3 37.78,8.41 37.78,11.59 36.99,12.38 28.73,12.38 28.73,15.88 27.94,16.67 IC2.2
N$18  (via drill 0.61)
  Top 0.254: v30.32,17.14 21.43,17.14 20.48,18.1 17.78,18.1 v16.19,19.68 | v14.92,20.95 14.61,20.64 10.32,20.64 v9.37,21.59
  Bottom 0.254: v30.32,17.14 29.21,17.14 IC2.1 | v14.92,20.95 v16.19,19.68 | v9.37,21.59 8.89,22.07 IC3.8
N$19  (via drill 0.61)
  Top 0.254: v28.26,1.75 v33.02,1.75
  Bottom 0.254: R15.2 24.77,6.67 24.77,6.03 D1.A 24.92,5.87 24.92,5.08 25.64,4.37 | v33.02,1.75 IC8.4 | 25.64,4.37 v28.26,1.75 | C9.+ 10.16,6.03 12.22,3.97 12.22,3.49 13.18,2.54 25.56,2.54 25.56,4.29 25.64,4.37
N$20  (via drill 0.61)
  Top 0.254: v6.35,17.46 18.57,17.46 20.16,15.88 24.13,15.88 24.77,15.24 IC10.25
  Bottom 0.254: v6.35,17.46 5.4,16.51 5.4,11.43 JP2.1
N$21  (via drill 0.61)
  Top 0.254: v19.37,19.05 20.32,19.05 20.95,18.41 24.13,18.41 24.77,17.78 IC10.23 | v16.67,5.08 16.35,5.4 7.62,5.4 2.86,10.16 2.86,11.43 JP2.2
  Bottom 0.254: v19.37,19.05 17.78,17.46 17.78,15.88 16.67,14.76 v16.67,5.08
N$22  (via drill 0.61)
  Top 0.254: R16.1 10.79,22.54 5.56,22.54 4.6,21.59 VREG2.3 | v5.87,8.41 6.83,7.46 10.64,7.46 11.43,6.67 C13.+
  Bottom 0.254: v5.87,8.41 3.97,10.32 3.97,18.1 3.49,18.57 3.49,19.68 4.45,20.64 4.45,21.59 VREG2.3
N$23
  Top 0.254: IC1.16 37.62,62.71 20.48,62.71 13.34,69.85 VREG1.1
  Bottom 0.254: IC1.16 39.37,57.47 C15.2 | C12.+ 19.05,68.42 13.34,68.42 13.34,69.85 VREG1.1
N$24  (via drill 0.61)
  Top 0.254: v40.8,34.61 41.27,35.08 v54.61,35.08 | v54.93,21.59 53.5,20.16 v51.91,20.16
  Bottom 0.254: v40.8,34.61 40.8,32.38 39.53,31.11 39.53,28.57 38.58,27.62 38.58,23.97 38.1,23.5 IC6.11 | v54.61,35.08 55.72,33.97 55.72,22.38 v54.93,21.59 | v51.91,20.16 50.8,19.05 IC7.4
N$25  (via drill 0.61)
  Top 0.254: SJ2.2 50.01,23.34 50.48,23.34 54.45,27.3 54.45,31.27 v48.26,31.27 | v46.83,36.99 46.35,36.51 28.57,36.51 28.1,36.04 22.23,36.04 v22.07,36.2 | v15.72,14.45 16.35,13.81 v17.62,13.81 | v18.26,10.48 18.57,10.79 26.67,10.79 27.62,9.84 30.96,9.84 31.75,9.05 IC10.2
  Bottom 0.254: v48.26,31.27 48.1,31.43 48.1,35.72 v46.83,36.99 | v22.07,36.2 20.16,34.29 20.16,31.11 18.89,29.84 18.89,26.51 17.3,24.92 17.3,16.19 15.72,14.61 v15.72,14.45 | v17.62,13.81 18.26,13.18 v18.26,10.48
N$26  (via drill 0.61)
  Top 0.254: v52.86,5.4 R17.2 | JP4.2 50.48,11.43 49.53,12.38 SJ1.1
  Bottom 0.254: v52.86,5.4 54.29,6.83 54.29,11.43 JP4.2
N$27  (via drill 0.61)
  Top 0.254: 37.31,66.2 38.26,66.2 39.21,65.25 39.37,65.25 R4.1 | 37.31,66.2 34.92,66.2 34.29,66.83 R1.2 | v24.77,63.66 24.92,63.5 34.61,63.5 37.31,66.2
  Bottom 0.254: C16.2 22.86,58.74 IC4.7 24.77,62.87 v24.77,63.66
N$30
  Bottom 0.254: IC6.12 39.37,23.34 39.85,22.86 39.85,22.23 40.16,21.91 46.2,21.91 46.2,24.77 47.94,26.51 49.21,26.51 49.21,23.81 49.53,23.5 IC7.10
N$31  (via drill 0.61)
  Top 0.254: v39.21,4.6 39.69,5.08 47.94,5.08 48.74,4.29 50.32,4.29 50.48,4.45 v54.61,4.45
  Bottom 0.254: IC8.3 34.29,3.97 35.4,2.86 39.21,2.86 v39.21,4.6 | v54.61,4.45 55.56,5.4 55.56,12.54 54.61,13.49 IC7.1
N$32  (via drill 0.61)
  Top 0.254: v46.04,8.26 48.26,10.48 v52.86,10.48 | v53.66,14.29 53.98,14.61 v55.56,14.61
  Bottom 0.254: v46.04,8.26 46.04,4.92 45.72,4.6 IC9.4 | v52.86,10.48 53.18,10.79 53.18,13.81 v53.66,14.29 | v55.56,14.61 55.4,14.76 55.4,19.84 53.34,21.91 IC7.13
N$33  (via drill 0.61)
  Top 0.254: v34.61,27.3 34.61,28.1 34.13,28.57 34.13,30.96 v33.97,30.96 | v46.83,38.89 v33.18,38.89
  Bottom 0.254: IC7.2 53.34,17.3 52.86,17.78 52.86,20.64 50.8,22.7 IC7.11 50.8,23.97 49.69,25.08 49.69,30.16 50.64,31.11 50.64,35.08 v46.83,38.89 | v34.61,27.3 34.61,23.81 34.29,23.5 IC6.8 | v33.97,30.96 33.18,31.75 v33.18,38.89
N$38  (via drill 0.61)
  Top 0.254: v19.05,4.13 20.48,2.7 v41.91,2.7
  Bottom 0.254: v19.05,4.13 R14.2 | v41.91,2.7 43.18,3.97 IC9.6 43.02,3.65 43.02,1.75 47.31,1.75 49.05,3.49 49.05,3.97 49.53,4.45 IC9.1
N$40  (via drill 0.61)
  Top 0.254: R3.2 24.13,69.53 | 24.13,69.53 R2.2 24.13,66.83 23.97,66.83 v21.43,64.29 | 24.13,69.53 50.48,69.53 JP3.1
  Bottom 0.254: IC4.1 20.32,55.56 C14.2 20.8,55.88 21.43,56.52 v21.43,64.29
N$41  (via drill 0.61)
  Top 0.254: v42.07,1.43 43.34,2.7 v46.99,2.7
  Bottom 0.254: v42.07,1.43 42.07,0.79 32.7,0.79 32.07,1.43 32.07,4.13 31.75,4.45 IC8.5 | v46.99,2.7 48.26,3.97 IC9.2
NMI
  Bottom 0.254: IC5.17 46.99,30.48 CN1.17
RD
  Bottom 0.254: IC7.12 52.07,23.5 52.23,23.65 52.23,31.11 53.34,32.23 IC5.21 53.34,46.99 CN1.21
RFSH
  Bottom 0.254: IC5.28 36.51,45.4 36.51,47.94 CN1.28
RST
  Top 0.254: IC1.13 49.21,63.18 56.04,63.18 56.2,63.02 56.2,42.7 42.86,42.7 41.12,44.45 IC5.26
  Bottom 0.254: IC5.26 41.27,45.09 41.27,47.62 CN1.26
VCC
  Bottom 0.254: IC5.11 31.75,30.48 CN1.11
WAIT
  Bottom 0.254: IC5.24 46.99,45.72 CN1.24
WR  (via drill 0.61)
  Top 0.254: v52.39,14.29 53.34,13.34 55.88,13.34 v57.15,14.61
  Bottom 0.254: v52.39,14.29 52.39,16.83 52.07,17.14 IC7.3 | v57.15,14.61 58.1,15.56 58.1,20.95 57.15,21.91 57.15,47.78 54.93,50.01 53.18,50.01 | 53.18,50.01 52.07,50.01 CN1.22 52.07,45.72 IC5.22 | IC1.11 53.18,59.85 53.18,50.01

### Text on the board
tNames: 22pF | 2.2k | 2.2k | 22pF | Version 1.3 | C3 | R5 | R7 | C4 | RBSC | (C) 2016 | +12 | GND | -12 | VREG1 | 170k | 22k | 2.2k | 2.2k | SPK | GND | SND | R3 | R10 | R8 | R6 | 78L05 | +12 | GND | -12 | 22k | 22k | 22k | 2.2k | SPK | GND | SND | JP1 | JP3 | R2 | R9 | R1 | R4 | PWR | OUT | 47uF | 47uF | + | AMP | OPLL | IC4 | IC1 | LM4558 | YM2413 | C6 | + | C5 | DIP40 MB CONNECTOR | CN1 | F4 Port schematics by Caro (2011) | FMPAC mono schematics by Jipe (2010) | Board design and improvements by RBSC (2016) | IC5 | F4/FMPAC Combo Board | Z80 CPU | SJ1 & SJ2: 1-2 for 27c128, 27c256 | 3 | VREG2 | For 27c512 connect OE to RD | R16 | SJ1 & SJ2: 2-3 for 27c512 | 2 | C8 | 1 | 68 | 100nF | EPROM | SJ2 | 78L05 | + | 1uF | 27c128 | 3 | JP2 | CE/OE | 27c256 | JP4 | ROMSEL | 2 | C10 | IC10 | 27c512 | 1 | SJ1 | + | 1uF | CE | OE | C13 | Russian Bear | Service Crew | Optional ROM | R17 | 10k | ROM | And Connectors | SLTSEL | CS1/RD | 27c256 | Selection
bNames: 68 | 1uF | 2.2uF | C7 | C2 | R11 | + | RBSC | + | Russian Bear | 1uF | 2.2uF | 2.2uF | Service Crew | C1 | + | + | (C) 2016 | 100 | 100 | Version 1.3 | R12 | R13 | F4/FMPAC Combo Board | Optional | C16 | C14 | 1nF | C15 | 1nF | 100nF | F4 Port schematics by Caro (2011) | FMPAC mono schematics by Jipe (2010) | Board design and improvements by RBSC (2016) | IC3 | IC2 | IC6 | IC7 | 74LS04 | 74LS30 | 74LS30 | 74LS02 | 100nF | 10uF | C11 | 4.7k | C9 | R15 | D1 | IC8 | IC9 | 1k | 74LS74 | R14 | 74LS125 | + | 1N4148 | Optional MSX2+ F4 Port